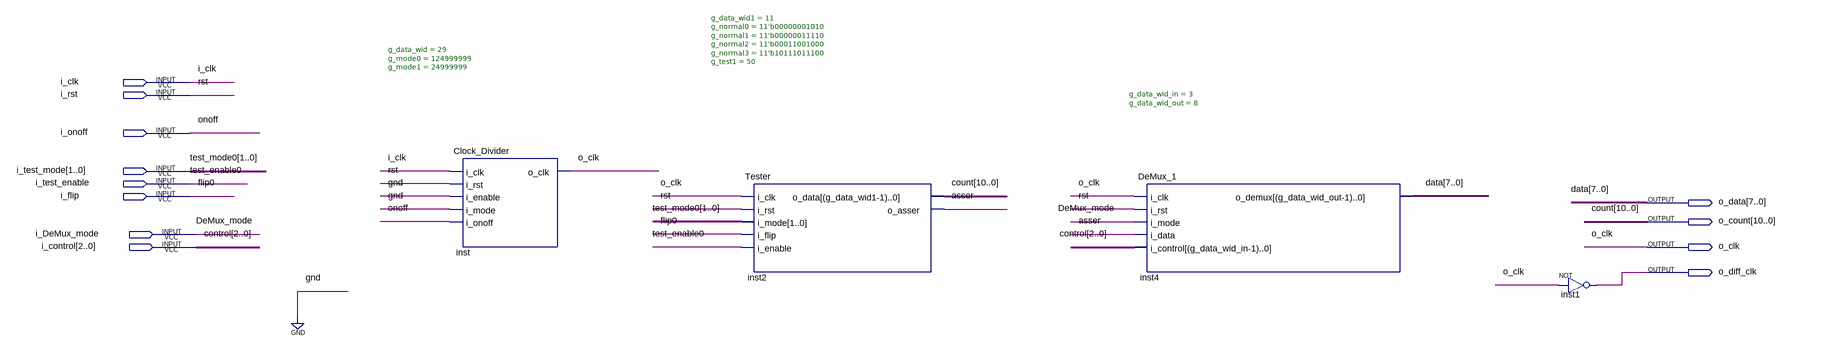
[diagram p0: schematic sheet]
// Quartus schematic Tester_2.bdf as structural Verilog: 4 symbols, 12 pins
module Tester_2 (
  input  i_clk,
  input  i_rst,
  input  i_onoff,
  input  [1:0] i_test_mode,
  input  i_test_enable,
  input  i_flip,
  input  i_DeMux_mode,
  input  [2:0] i_control,
  output [7:0] o_data,
  output [10:0] o_count,
  output o_clk,
  output o_diff_clk
);

  wire asser;

  Clock_Divider #(.g_data_wid(29), .g_mode0(124999999), .g_mode1(24999999)) inst (
    .i_clk(i_clk), .i_rst(i_rst), .i_enable(1'b0), .i_mode(1'b0), .i_onoff(i_onoff), .o_clk(o_clk));
  Tester #(.g_data_wid1(11), .g_normal0(11'b00000001010), .g_normal1(11'b00000011110), .g_normal2(11'b00011001000), .g_normal3(11'b10111011100), .g_test1(50)) inst2 (
    .i_clk(o_clk), .i_rst(i_rst), .i_mode(i_test_mode), .i_flip(i_flip), .i_enable(i_test_enable),
    .o_data(o_count), .o_asser(asser));
  DeMux_1 #(.g_data_wid_in(3), .g_data_wid_out(8)) inst4 (
    .i_clk(o_clk), .i_rst(i_rst), .i_mode(i_DeMux_mode), .i_data(asser), .i_control(i_control),
    .o_demux(o_data));
  not inst1 (o_diff_clk, o_clk);

  // Other names for the same wires on the sheet: control[2:0] = i_control; count[10:0] = o_count; data[7:0] = o_data;
  //   DeMux_mode = i_DeMux_mode; flip0 = i_flip; onoff = i_onoff; rst = i_rst; test_enable0 = i_test_enable;
  //   test_mode0[1:0] = i_test_mode
endmodule
